# EAGLE schematic M_O_ext_bluetooth_BT5011A (EAGLE 9.6.2)
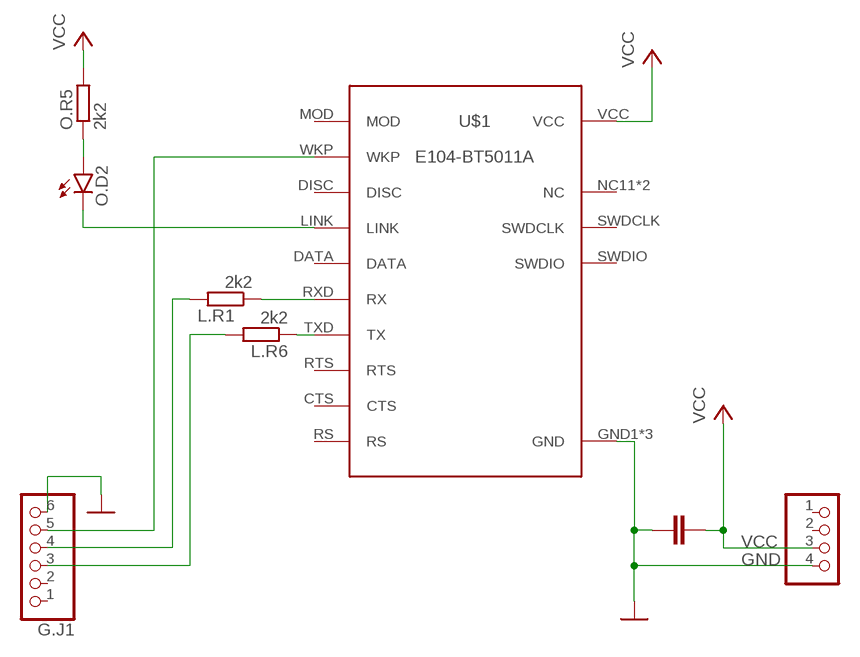
[diagram p0: schematic, sheet 1]

## Parts
G.J1  PINHD-1X6  [1X06]
G.J2  PINHD-1X4  [1X04]
L.C1  100n  C-EUC0603  [C0603]
L.R1  2k2  R-EU_R0603  [R0603]
L.R6  2k2  R-EU_R0603  [R0603]
O.D2  LEDCHIP-LED0603  [CHIP-LED0603]
O.R5  2k2  R-EU_R0603  [R0603]
U$1  E104-BT5011A  [E104-BT5011A]

## Nets
GND: G.J1.6 G.J2.4 L.C1.1 U$1.GND1(GND) U$1.GND2(GND) U$1.GND3(GND)
N$1: L.R6.1 U$1.TXD(TX)
N$2: G.J1.4 L.R1.2
N$3: L.R1.1 U$1.RXD(RX)
N$4: G.J1.5 U$1.WKP
N$6: O.D2.C1(C) U$1.LINK
N$10: O.D2.A1(A) O.R5.1
VCC: G.J2.3 L.C1.2 O.R5.2 U$1.VCC
VCC1: G.J1.3 L.R6.2
Unconnected: G.J1.1 G.J1.2 G.J2.1 G.J2.2 U$1.CTS U$1.DATA U$1.DISC U$1.MOD U$1.NC11(NC) U$1.NC12(NC) U$1.RS U$1.RTS U$1.SWDCLK U$1.SWDIO

## Library data of the parts
G.J1 = pinhead2:PINHD-1X6: PIN HEADER
G.J2 = pinhead2:PINHD-1X4: PIN HEADER
L.C1 = rcl:C-EU: CAPACITOR, European symbol; SPICEPREFIX: C
L.R1 L.R6 O.R5 = rcl:R-EU_: RESISTOR, European symbol; SPICEPREFIX: R
O.D2 = led:LED: LED OSRAM: - CHIPLED LG R971, LG N971, LY N971, LG Q971, LY Q971, LO R971, LY R971 LH N974, LH R974 LS Q976, LO Q976, LY Q976 LO Q996 - Hyper CHIPLED LW Q18S LB Q993, LB Q99A, LB R99A - SideLED LS A670, LO A670, LY A670, LG A670, LP A670 LB A673, LV A673, LT A673, LW A673 LH A674 LY A675 LS A676, LA A676, LO A676, LY A676, LW A676 LS A679, LY A679, LG A679 - Hyper Micro SIDELED® LS Y876, LA Y876, LO Y876, LY Y876 LT Y87S - SmartLED LW L88C, LW L88S LB L89C, LB L89S, LG L890 LS L89K, LO L89K, LY L89K LS L896, LA L896, LO L896, LY L896 - TOPLED LS T670, LO T670, LY T670, LG T670, LP T670 LSG T670, LSP T670, LSY T670, LOP T670, LYG T670 LG T671, LOG T671, LSG T671 LB T673, LV T673, LT T673, LW T673 LH T674 LS T676, LA T676, LO T676, LY T676, LB T676, LH T676, LSB T676, LW T676 LB T67C, LV T67C, LT T67C, LS T67K, LO T67K, LY T67K, LW E67C LS E67B, LA E67B, LO E67B, LY E67B, LB E67C, LV E67C, LT E67C LW T67C LS T679, LY T679, LG T679 LS T770, LO T770, LY T770, LG T770, LP T770 LB T773, LV T773, LT T773, LW T773 LH T774 LS E675, LA E675, LY E675, LS T675 LS T776, LA T776, LO T776, LY T776, LB T776 LHGB T686 LT T68C, LB T68C - Hyper Mini TOPLED® LB M676 - Mini TOPLED Santana® LG M470 LS M47K, LO M47K, LY M47K Source: http://www.osram.convergy.de LUXEON: - LUMILED® LXK2-PW12-R00, LXK2-PW12-S00, LXK2-PW14-U00, LXK2-PW14-V00 LXK2-PM12-R00, LXK2-PM12-S00, LXK2-PM14-U00 LXK2-PE12-Q00, LXK2-PE12-R00, LXK2-PE12-S00, LXK2-PE14-T00, LXK2-PE14-U00 LXK2-PB12-K00, LXK2-PB12-L00, LXK2-PB12-M00, LXK2-PB14-N00, LXK2-PB14-P00, LXK2-PB14-Q00 LXK2-PR12-L00, LXK2-PR12-M00, LXK2-PR14-Q00, LXK2-PR14-R00 LXK2-PD12-Q00, LXK2-PD12-R00, LXK2-PD12-S00 LXK2-PH12-R00, LXK2-PH12-S00 LXK2-PL12-P00, LXK2-PL12-Q00, LXK2-PL12-R00 Source: www.luxeon.com KINGBRIGHT: KA-3528ASYC Source: www.kingbright.com
U$1 = hugo:E104-BT5011A